# Altium schematic sheet 10_MIPI_LCD_TX2.SchDoc
size 297 x 209 mm
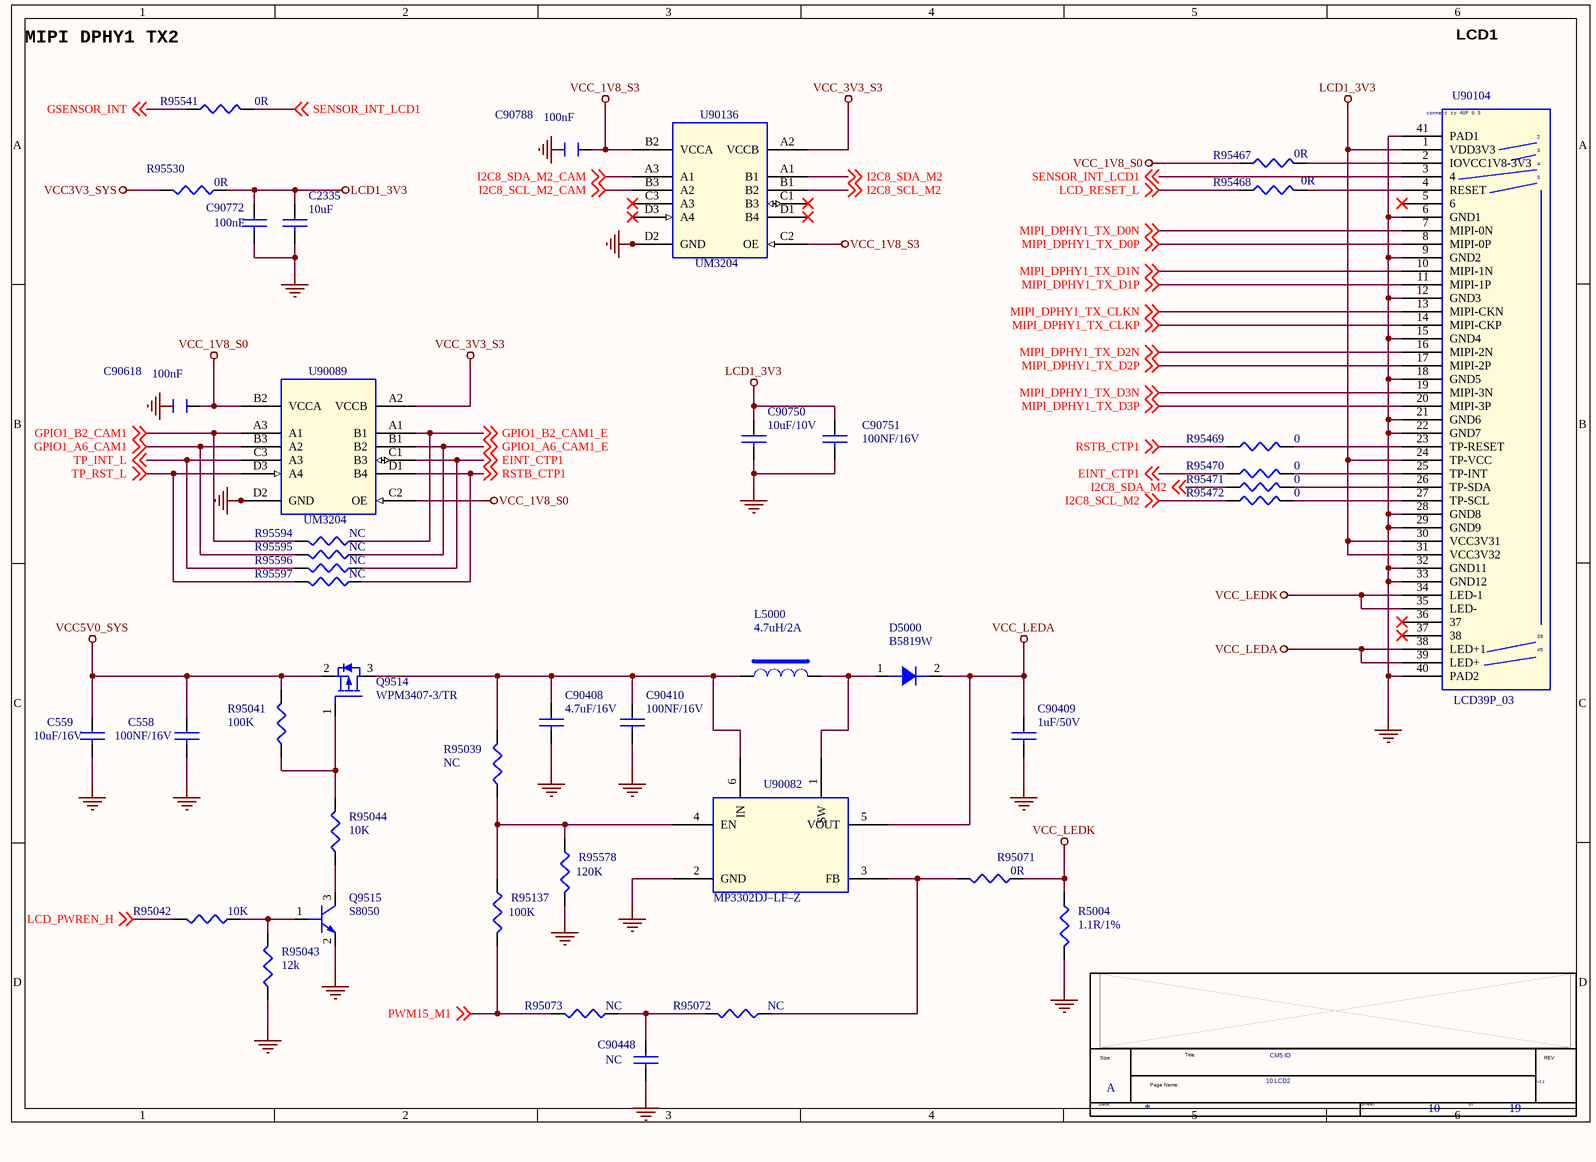
[diagram p0: 10_MIPI_LCD_TX2.SchDoc]

## Parts
*  Doc: 10.LCD2  RevCode: V2.2  Title: CM5 IO  Page Size: A  Page Number: 10  Page Count: 19  (hidden comment: radxa_1010)  (graphical)
C558  100NF/16V  [C0402]
C559  10uF/16V  [C0603]
C2335  10uF  [C0603]
C90408  4.7uF/16V  [C0603]
C90409  1uF/50V  [C0603]
C90410  100NF/16V  [C0402]
C90448  NC  [C0402]
C90618  100nF  [C0402]
C90750  10uF/10V  [C0603]
C90751  100NF/16V  [C0402]
C90772  100nF  [C0402]
C90788  100nF  [C0402]
D5000  B5819W  [SOD_123]
L5000  4.7uH/2A  [IND-303015]
Q9514  WPM3407-3/TR  [SOT23]
Q9515  S8050  [SOT_23]
R5004  1.1R/1%  [R0402]
R95039  NC  [R0402]
R95041  100K  [R0402]
R95042  10K  [R0402]
R95043  12k  [R0402]
R95044  10K  [R0402]
R95071  0R  [R0402]
R95072  NC  [R0402]
R95073  NC  [R0402]
R95137  100K  [R0402]
R95467  0R  [R0402]
R95468  0R  [R0402]
R95469  0  [R0201]
R95470  0  [R0201]
R95471  0  [R0201]
R95472  0  [R0201]
R95530  0R  [R0402]
R95541  0R  [R0402]
R95578  120K  [R0402]
R95594  NC  [R0402]
R95595  NC  [R0402]
R95596  NC  [R0402]
R95597  NC  [R0402]
U90082  MP3302DJ–LF–Z  [sot23-6]
U90089  UM3204  [CSP-12]
U90104  LCD39P_03  [LCD39PIN-ok]
U90136  UM3204  [CSP-12]

## Nets
GND: C558.2 C559.2 C2335.2 C90408.2 C90409.2 C90410.2 C90448.2 C90750.2 C90751.2 C90772.2 Q9515.2(EMITTER) R5004.2 R95043.2 R95578.1 U90082.2(GND) U90089.D2(GND) U90104.6(GND1) U90104.9(GND2) U90104.12(GND3) U90104.15(GND4) U90104.18(GND5) U90104.21(GND6) U90104.22(GND7) U90104.28(GND8) U90104.29(GND9) U90104.32(GND11) U90104.33(GND12) U90104.40(PAD2) U90104.41(PAD1) U90136.D2(GND)
LCD1_3V3: C2335.1 C90750.1 C90751.1 C90772.1 R95530.2 U90104.1(VDD3V3) U90104.24(TP-VCC) U90104.30(VCC3V31) U90104.31(VCC3V32)
VCC3V3_SYS: R95530.1
VCC5V0_SYS: C558.1 C559.1 Q9514.2(SOURCE) R95041.1
VCC_1V8_S0: C90618.2 R95467.1 U90089.B2(VCCA) U90089.C2(OE)
VCC_1V8_S3: C90788.2 U90136.B2(VCCA) U90136.C2(OE)
VCC_3V3_S3: U90089.A2(VCCB) U90136.A2(VCCB)
VCC_LEDA: C90409.1 D5000.2(K) U90082.5(VOUT) U90104.38(LED+1) U90104.39(LED+)
VCC_LEDK: R5004.1 R95071.2 U90104.34(LED-1) U90104.35(LED-)
EINT_CTP1: R95470.1 R95596.2 U90089.C1(B3) ; off-sheet EINT_CTP1
GPIO1_A6_CAM1: R95595.1 U90089.B3(A2) ; off-sheet GPIO1_A6_CAM1
GPIO1_A6_CAM1_E: R95595.2 U90089.B1(B2) ; off-sheet GPIO1_A6_CAM1_E
GPIO1_B2_CAM1: R95594.1 U90089.A3(A1) ; off-sheet GPIO1_B2_CAM1
GPIO1_B2_CAM1_E: R95594.2 U90089.A1(B1) ; off-sheet GPIO1_B2_CAM1_E
GSENSOR_INT: R95541.2 ; off-sheet GSENSOR_INT
I2C8_SCL_M2: R95472.1 U90136.B1(B2) ; off-sheet I2C8_SCL_M2
I2C8_SCL_M2_CAM: U90136.B3(A2) ; off-sheet I2C8_SCL_M2_CAM
I2C8_SDA_M2: R95471.1 U90136.A1(B1) ; off-sheet I2C8_SDA_M2
I2C8_SDA_M2_CAM: U90136.A3(A1) ; off-sheet I2C8_SDA_M2_CAM
LCD_PWREN_H: R95042.1 ; off-sheet LCD_PWREN_H
LCD_RESET_L: R95468.1 ; off-sheet LCD_RESET_L
MIPI_DPHY1_TX_CLKN: U90104.13(MIPI-CKN) ; off-sheet MIPI_DPHY1_TX_CLKN
MIPI_DPHY1_TX_CLKP: U90104.14(MIPI-CKP) ; off-sheet MIPI_DPHY1_TX_CLKP
MIPI_DPHY1_TX_D0N: U90104.7(MIPI-0N) ; off-sheet MIPI_DPHY1_TX_D0N
MIPI_DPHY1_TX_D0P: U90104.8(MIPI-0P) ; off-sheet MIPI_DPHY1_TX_D0P
MIPI_DPHY1_TX_D1N: U90104.10(MIPI-1N) ; off-sheet MIPI_DPHY1_TX_D1N
MIPI_DPHY1_TX_D1P: U90104.11(MIPI-1P) ; off-sheet MIPI_DPHY1_TX_D1P
MIPI_DPHY1_TX_D2N: U90104.16(MIPI-2N) ; off-sheet MIPI_DPHY1_TX_D2N
MIPI_DPHY1_TX_D2P: U90104.17(MIPI-2P) ; off-sheet MIPI_DPHY1_TX_D2P
MIPI_DPHY1_TX_D3N: U90104.19(MIPI-3N) ; off-sheet MIPI_DPHY1_TX_D3N
MIPI_DPHY1_TX_D3P: U90104.20(MIPI-3P) ; off-sheet MIPI_DPHY1_TX_D3P
PWM15_M1: R95073.1 R95137.1 ; off-sheet PWM15_M1
RSTB_CTP1: R95469.1 R95597.2 U90089.D1(B4) ; off-sheet RSTB_CTP1
SENSOR_INT_LCD1: R95541.1 U90104.3(4) ; off-sheet SENSOR_INT_LCD1
TP_INT_L: R95596.1 U90089.C3(A3) ; off-sheet TP_INT_L
TP_RST_L: R95597.1 U90089.D3(A4) ; off-sheet TP_RST_L
NetC90408_1: C90408.1 C90410.1 L5000.1 Q9514.3(DRAIN) R95039.1 U90082.6(IN)
NetC90448_1: C90448.1 R95072.1 R95073.2
NetD5000_1: D5000.1(A) L5000.2 U90082.1(SW)
NetQ9514_1: Q9514.1(GATE) R95041.2 R95044.1
NetQ9515_1: Q9515.1(BASE) R95042.2 R95043.1
NetQ9515_3: Q9515.3(COLLECTOR) R95044.2
NetR95039_2: R95039.2 R95137.2 R95578.2 U90082.4(EN)
NetR95071_1: R95071.1 R95072.2 U90082.3(FB)
NetR95467_2: R95467.2 U90104.2(IOVCC1V8-3V3)
NetR95468_2: R95468.2 U90104.4(RESET)
NetR95469_2: R95469.2 U90104.23(TP-RESET)
NetR95470_2: R95470.2 U90104.25(TP-INT)
NetR95471_2: R95471.2 U90104.26(TP-SDA)
NetR95472_2: R95472.2 U90104.27(TP-SCL)

Not connected (* = marked no-connect by the designer): C90618 1; C90788 1; U90104 5(6)* 36(37)* 37(38)*; U90136 C1(B3)* C3(A3)* D1(B4)* D3(A4)*

## Notes on the sheet
- MIPI DPHY1 TX2
- LCD1
- Labels drawn without touching a wire or pin: GND
- (in symbol LCD39P_03) connect to 40P 0.5
- (in symbol radxa_1010) Size; Title:; REV; Page Name:; Date:; Sheet; of

## Library data of the parts
C558 = CAP NP_0_Dup2: cap,100.00nF,+/-10%,16V,X5R,C0402; Manufacturer: TDK; Number: 37; RK PN: C1005X5R1C104K050BA; Priority: A; Tolerance: 10%; C_Voltage: 6.3V; Voltage: 16V; PCB Footprint: C0402; Dielectric: X5R; Part Type: C0402; Manufacturer PN: C1005X5R1C104K050BA; Created by: JJJ
C559 = CAP NP_0_Dup2: cap,10.00uF,+/-10%,10V,X5R,C0603; Manufacturer PN: C1608X5R1A106K080AC; Manufacturer: TDK; Tolerance: 10%; C_Voltage: 6.3V; Priority: A; Voltage: 10V; PCB Footprint: C0603; Dielectric: X5R; Created by: JJJ; Part Type: C0603; RK PN: C1608X5R1A106K080AC
C2335 C90750 = CAP NP_0_Dup2: cap,10.00uF,+/-10%,10V,X5R,C0603; Manufacturer: TDK; RK PN: C1608X5R1A106K080AC; Priority: A; C_Voltage: 6.3V; Tolerance: 10%; Voltage: 10V; PCB Footprint: C0603; Dielectric: X5R; Part Type: C0603; Manufacturer PN: C1608X5R1A106K080AC; Created by: JJJ
C90408 = CAP NP_0_Dup2: cap,4.70uF,+/-10%,10V,X5R,C0603; Manufacturer: TDK; RK PN: C1608X5R1A475K080AC; Priority: A; Tolerance: 10%; Voltage: 10V; PCB Footprint: C0603; Dielectric: X5R; Part Type: C0603; Manufacturer PN: C1608X5R1A475K080AC; Created by: JJJ
C90409 = CAP NP_0_Dup2: cap,2.20uF,+/-10%,35V,X5R,C0603; Manufacturer: TDK; RK PN: C1608X5R1V225K080AC; Priority: A; Tolerance: 10%; Voltage: 35V; PCB Footprint: C0603; Dielectric: X5R; Part Type: C0603; Manufacturer PN: C1608X5R1V225K080AC; Created by: JJJ
C90410 C90448 C90772 = CAP NP_0_Dup2: cap,100.00nF,+/-10%,16V,X5R,C0402; Manufacturer: TDK; RK PN: C1005X5R1C104K050BA; Priority: A; Tolerance: 10%; Voltage: 16V; PCB Footprint: C0402; Dielectric: X5R; Part Type: C0402; Manufacturer PN: C1005X5R1C104K050BA; Created by: JJJ
C90618 C90788 = CAPACITOR_0: PAGE: 1; PCB Footprint: C0402
C90751 = CAP NP_0_Dup2: cap,100.00nF,+/-10%,16V,X5R,C0402; Manufacturer PN: C1005X5R1C104K050BA; Manufacturer: TDK; C_Voltage: 6.3V; Tolerance: 10%; Priority: A; Number: 37; Voltage: 16V; PCB Footprint: C0402; Dielectric: X5R; Created by: JJJ; Part Type: C0402; RK PN: C1005X5R1C104K050BA
D5000 = DIODE_Dup1: Schottky Barrier，SS32 DO214AC; Manufacturer: 星海; RK PN: SS32; Priority: A; PCB Footprint: SOD_123; Part Type: Schottky rectifier; Manufacturer PN: SS32; Created by: JJJ
L5000 = INDUCTORS OF FERRITE_Dup1: Power Inductor,4.7uH,0.2,IND_404030; Manufacturer: sunlord; DC Resistor: 0.06ohm; Isat: 2.9A; RK PN: SWPA4030S4R7MT; Priority: A; Tolerance: 20%; Irms: 2A; Resonace frequency: 31M; PCB Footprint: IND-303015; Part Type: POWER_IND; Manufacturer PN: SWPA4030S4R7MT; Created by: YTL
Q9514 = MOSFET P: PMOS,WPM3407-3/TR,SOT_23,Id=4.4A,Vds=30V; Manufacturer: WillSemi(韦尔半导体); Pd: 0.9W; Vgsth: 2.0V; VDS: 30V; Vgs: ±20V; Id_max: 4.4A; Priority: A; PCB Footprint: SOT_23; Created by: JJJ; Manufacturer PN: WPM3407-3/TR; Part Type: PMOS; RK PN: WPM3407-3/TR
Q9515 = NPN: S8050,SOT23; Manufacturer: 长电; Manufacturer PN: S8050_SOT23; Priority: A; Ic: 0.5A; Vceo: 25V; Pc: 0.3W; PCB Footprint: SOT_23; RK PN: S8050; Part Type: NPN; Created by: JJJ
R5004 = RESISTOR_1_Dup1: 通用厚膜电阻,3R9,+/-5%,R1206,1/4W.; Manufacturer PN: RC1206JR-073R9L; Manufacturer: YAGEO; Tolerance: 5%; Wattage: 1/4W; Priority: A; PCB Footprint: R1206; Created by: YTL; Part Type: 通用厚膜电阻; RK PN: RC1206JR-073R9L
R95039 R95071 R95072 = RESISTOR_1_Dup1: 通用厚膜电阻,27K,+/-5%,R0402,1/16W.; Manufacturer PN: RC0402JR-0727KL; Manufacturer: YAGEO; PCB Footprint: R0201; Tolerance: 5%; OPTION: DNP; Wattage: 1/16W; Priority: A; Created by: YTL; Part Type: 通用厚膜电阻; RK PN: RC0402JR-0727KL
R95041 R95042 R95044 = RESISTOR_1_Dup1: 通用厚膜电阻,10K,+/-5%,R0402,1/16W.; Manufacturer PN: RC0402JR-0710KL; Manufacturer: YAGEO; PCB Footprint: R0201; Tolerance: 5%; Wattage: 1/16W; Priority: A; Created by: YTL; Part Type: 通用厚膜电阻; RK PN: RC0402JR-0710KL
R95043 = RESISTOR_1_Dup1: 通用厚膜电阻,20K,+/-5%,R0402,1/16W.; Manufacturer PN: RC0402JR-0720KL; Manufacturer: YAGEO; PCB Footprint: R0201; Tolerance: 5%; Wattage: 1/16W; Priority: A; Created by: YTL; Part Type: 通用厚膜电阻; RK PN: RC0402JR-0720KL
R95073 R95137 R95578 = RESISTOR_1_Dup1: 通用厚膜电阻,27K,+/-5%,R0402,1/16W.; Manufacturer: YAGEO; PCB Footprint: R0201; Tolerance: 5%; RK PN: RC0402JR-0727KL; Priority: A; Wattage: 1/16W; OPTION: DNP; Part Type: 通用厚膜电阻; Manufacturer PN: RC0402JR-0727KL; Created by: YTL
R95467 = RESISTOR_1_Dup1: 通用厚膜电阻,100K,+/-5%,R0402,1/16W.; Manufacturer: YAGEO; PCB Footprint: R0201; Tolerance: 5%; RK PN: RC0402JR-07100KL; Priority: A; Wattage: 1/16W; Part Type: 通用厚膜电阻; Manufacturer PN: RC0402JR-07100KL; Created by: YTL
R95468 = RESISTOR_1_Dup1: 通用厚膜电阻,100K,+/-5%,R0402,1/16W.; Manufacturer PN: RC0402JR-07100KL; Manufacturer: YAGEO; Tolerance: 5%; Wattage: 1/16W; Priority: A; PCB Footprint: R0402; Created by: YTL; Part Type: 通用厚膜电阻; RK PN: RC0402JR-07100KL
R95469-R95471 = R / 0 / ohm / 0201_0: FunctionGroup: BB; FS: Y; FPLIST: R0201,M0201; ebom: X / BB / DEBUG IF; Free_Sample: Y; PCB Footprint: R0201
R95472 = R / 0 / ohm / 0201_0: ebom: X / BB / DEBUG IF; Free_Sample: Y; FPLIST: R0201,M0201; FunctionGroup: BB; FS: Y; PCB Footprint: R0201
R95530 R95541 R95594-R95597 = RESISTOR_1_Dup1: 通用厚膜电阻,10K,+/-5%,R0402,1/16W.; Manufacturer PN: RC0402JR-0710KL; Manufacturer: YAGEO; Tolerance: 5%; Wattage: 1/16W; Priority: A; PCB Footprint: R0402; Created by: YTL; Part Type: 通用厚膜电阻; RK PN: RC0402JR-0710KL
U90082 = MP3302_0: PCB Footprint: sot23-6
U90089 U90136 = MP2610_0: 4-bit Bi-directional Level Shifter  UM3204H; Part Number: PI4ULS5V104GAEX; Vendor: PERICOM; PCB Footprint: CSP-12
* = radxa_1010: Page Create Date: March  8, 1995; Page Modify Date: *
U90104 = LCD39P_03: PCB Footprint: LCD39PIN-ok